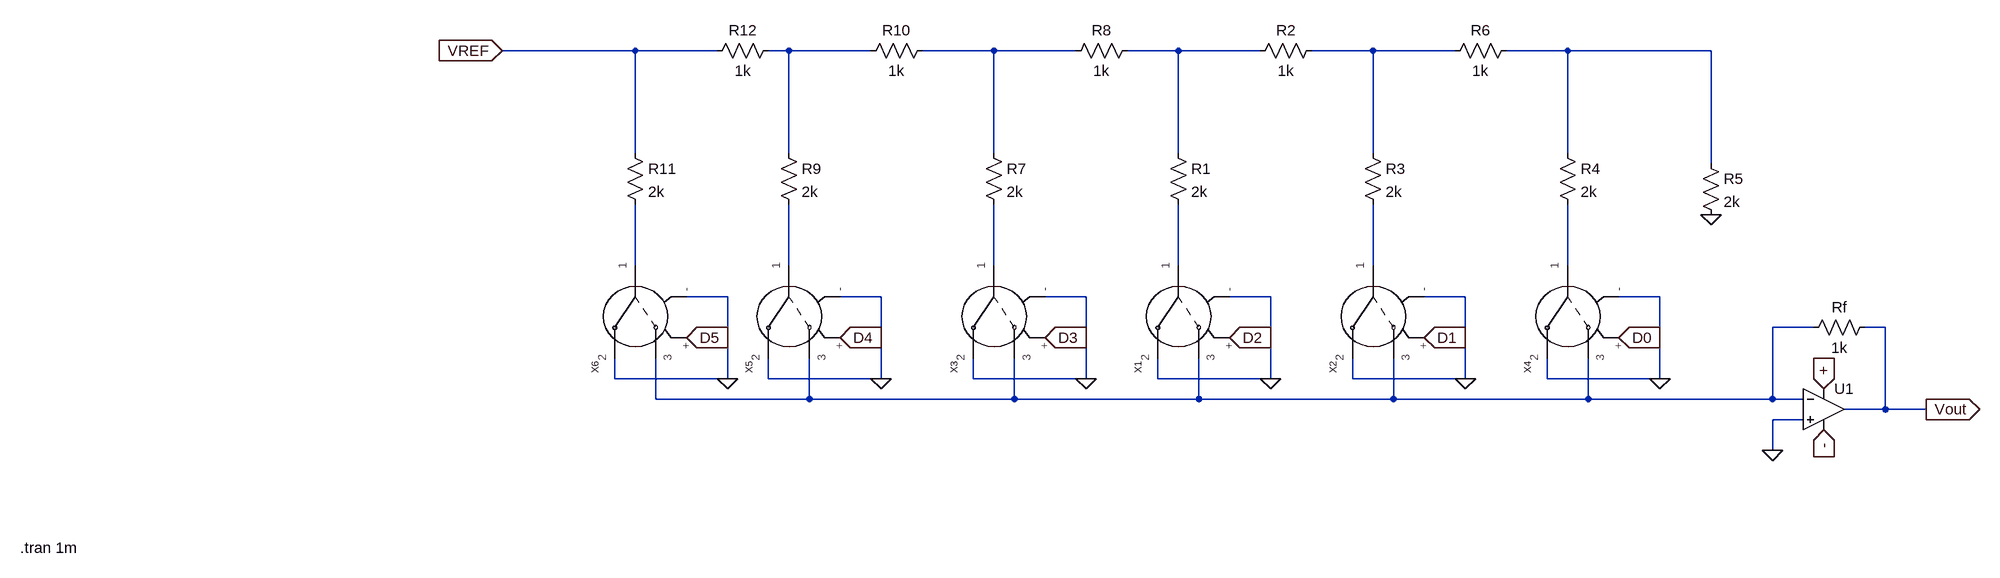
[diagram p0: schematic DAC_6 .asc]
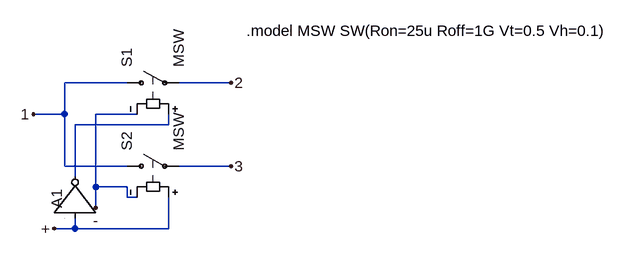
[diagram p1: sub-circuit spdt.asc]
DAC_6 .asc, the LTspice schematic file:
Version 4
SHEET 1 2528 680
WIRE 400 -320 192 -320
WIRE 528 -320 400 -320
WIRE 640 -320 608 -320
WIRE 768 -320 640 -320
WIRE 960 -320 848 -320
WIRE 1088 -320 960 -320
WIRE 1248 -320 1168 -320
WIRE 1376 -320 1248 -320
WIRE 1552 -320 1456 -320
WIRE 1680 -320 1552 -320
WIRE 1856 -320 1760 -320
WIRE 2080 -320 1856 -320
WIRE 400 -160 400 -320
WIRE 640 -160 640 -320
WIRE 960 -160 960 -320
WIRE 1248 -160 1248 -320
WIRE 1552 -160 1552 -320
WIRE 1856 -160 1856 -320
WIRE 2080 -144 2080 -320
WIRE 400 16 400 -80
WIRE 640 16 640 -80
WIRE 960 16 960 -80
WIRE 1248 16 1248 -80
WIRE 1552 16 1552 -80
WIRE 1856 16 1856 -80
WIRE 544 64 480 64
WIRE 784 64 720 64
WIRE 1104 64 1040 64
WIRE 1392 64 1328 64
WIRE 1696 64 1632 64
WIRE 2000 64 1936 64
WIRE 2240 112 2176 112
WIRE 2352 112 2320 112
WIRE 368 192 368 160
WIRE 544 192 544 64
WIRE 544 192 368 192
WIRE 608 192 608 160
WIRE 784 192 784 64
WIRE 784 192 608 192
WIRE 928 192 928 160
WIRE 1104 192 1104 64
WIRE 1104 192 928 192
WIRE 1216 192 1216 160
WIRE 1392 192 1392 64
WIRE 1392 192 1216 192
WIRE 1520 192 1520 160
WIRE 1696 192 1696 64
WIRE 1696 192 1520 192
WIRE 1824 192 1824 160
WIRE 2000 192 2000 64
WIRE 2000 192 1824 192
WIRE 432 224 432 160
WIRE 672 224 672 160
WIRE 672 224 432 224
WIRE 992 224 992 160
WIRE 992 224 672 224
WIRE 1280 224 1280 160
WIRE 1280 224 992 224
WIRE 1584 224 1584 160
WIRE 1584 224 1280 224
WIRE 1888 224 1888 160
WIRE 1888 224 1584 224
WIRE 2176 224 2176 112
WIRE 2176 224 1888 224
WIRE 2224 224 2176 224
WIRE 2352 240 2352 112
WIRE 2352 240 2288 240
WIRE 2416 240 2352 240
WIRE 2224 256 2176 256
WIRE 2176 304 2176 256
FLAG 2080 -64 0
FLAG 2416 240 Vout
IOPIN 2416 240 Out
FLAG 2176 304 0
FLAG 1936 128 D0
IOPIN 1936 128 In
FLAG 2000 192 0
FLAG 1632 128 D1
IOPIN 1632 128 In
FLAG 1696 192 0
FLAG 192 -320 VREF
IOPIN 192 -320 In
FLAG 2256 208 +
IOPIN 2256 208 In
FLAG 2256 272 -
IOPIN 2256 272 In
FLAG 1328 128 D2
IOPIN 1328 128 In
FLAG 1392 192 0
FLAG 1040 128 D3
IOPIN 1040 128 In
FLAG 1104 192 0
FLAG 720 128 D4
IOPIN 720 128 In
FLAG 784 192 0
FLAG 480 128 D5
IOPIN 480 128 In
FLAG 544 192 0
SYMBOL SPDT 1856 64 M90
SYMATTR InstName X4
SYMBOL res 1536 -176 R0
SYMATTR InstName R3
SYMATTR Value 2k
SYMBOL res 1840 -176 R0
SYMATTR InstName R4
SYMATTR Value 2k
SYMBOL res 2064 -160 R0
SYMATTR InstName R5
SYMATTR Value 2k
SYMBOL res 1776 -336 R90
WINDOW 0 0 56 VBottom 2
WINDOW 3 32 56 VTop 2
SYMATTR InstName R6
SYMATTR Value 1k
SYMBOL res 2336 96 R90
WINDOW 0 0 56 VBottom 2
WINDOW 3 32 56 VTop 2
SYMATTR InstName Rf
SYMATTR Value 1k
SYMBOL OpAmps\\UniversalOpAmp 2256 240 R0
SYMATTR InstName U1
SYMBOL SPDT 1552 64 M90
SYMATTR InstName X2
SYMBOL res 1232 -176 R0
SYMATTR InstName R1
SYMATTR Value 2k
SYMBOL res 1472 -336 R90
WINDOW 0 0 56 VBottom 2
WINDOW 3 32 56 VTop 2
SYMATTR InstName R2
SYMATTR Value 1k
SYMBOL SPDT 1248 64 M90
SYMATTR InstName X1
SYMBOL res 944 -176 R0
SYMATTR InstName R7
SYMATTR Value 2k
SYMBOL res 1184 -336 R90
WINDOW 0 0 56 VBottom 2
WINDOW 3 32 56 VTop 2
SYMATTR InstName R8
SYMATTR Value 1k
SYMBOL SPDT 960 64 M90
SYMATTR InstName X3
SYMBOL res 624 -176 R0
SYMATTR InstName R9
SYMATTR Value 2k
SYMBOL res 864 -336 R90
WINDOW 0 0 56 VBottom 2
WINDOW 3 32 56 VTop 2
SYMATTR InstName R10
SYMATTR Value 1k
SYMBOL SPDT 640 64 M90
SYMATTR InstName X5
SYMBOL res 384 -176 R0
SYMATTR InstName R11
SYMATTR Value 2k
SYMBOL res 624 -336 R90
WINDOW 0 0 56 VBottom 2
WINDOW 3 32 56 VTop 2
SYMATTR InstName R12
SYMATTR Value 1k
SYMBOL SPDT 400 64 M90
SYMATTR InstName X6
TEXT -560 456 Left 2 !.tran 1m

spdt.asc, the sub-circuit schematic file:
Version 4
SHEET 1 932 680
WIRE 144 96 48 96
WIRE 304 96 224 96
WIRE 48 144 48 96
WIRE 48 144 0 144
WIRE 160 144 96 144
WIRE 208 160 208 144
WIRE 208 160 64 160
WIRE 48 224 48 144
WIRE 144 224 48 224
WIRE 304 224 224 224
WIRE 64 240 64 160
WIRE 96 256 96 144
WIRE 144 256 96 256
WIRE 144 272 144 256
WIRE 160 272 144 272
WIRE 96 288 96 256
WIRE 64 320 64 304
WIRE 64 320 32 320
WIRE 208 320 208 272
WIRE 208 320 64 320
FLAG 0 144 1
FLAG 304 96 2
FLAG 304 224 3
FLAG 32 320 +
FLAG 96 288 -
SYMBOL sw 128 96 R270
SYMATTR InstName S1
SYMATTR Value MSW
SYMBOL sw 128 224 R270
SYMATTR InstName S2
SYMATTR Value MSW
SYMBOL Digital\\inv 128 304 M270
WINDOW 3 8 60 Invisible 2
WINDOW 0 15 92 Left 2
SYMATTR Value td=10n Vhigh=5
SYMATTR InstName A1
TEXT 328 16 Left 2 !.model MSW SW(Ron=25u Roff=1G Vt=0.5 Vh=0.1)

The netlist it stands for:
* DAC_6 .asc
XX4 N011 0 N012 D0 0 spdt
R3 N004 N010 2k
R4 N005 N011 2k
R5 N005 0 2k
R6 N005 N004 1k
Rf Vout N012 1k
XU1 0 N012 + - Vout level1 Avol=1Meg GBW=10Meg Vos=0 En=0 Enk=0 In=0 Ink=0 Rin=500Meg  ; pins In+ In- V+ V- OUT
XX2 N010 0 N012 D1 0 spdt
R1 N003 N009 2k
R2 N004 N003 1k
XX1 N009 0 N012 D2 0 spdt
R7 N002 N008 2k
R8 N003 N002 1k
XX3 N008 0 N012 D3 0 spdt
R9 N001 N007 2k
R10 N002 N001 1k
XX5 N007 0 N012 D4 0 spdt
R11 VREF N006 2k
R12 N001 VREF 1k
XX6 N006 0 N012 D5 0 spdt

* block symbol definitions
.subckt spdt 1 2 3 + -
S1 1 2 N001 - MSW
S2 1 3 + - MSW
A1 + 0 0 0 0 N001 0 0 BUF td=10n Vhigh=5
.model MSW SW(Ron=25u Roff=1G Vt=0.5 Vh=0.1)
.ends spdt

.tran 1m
.lib UniversalOpAmp1.lib
.backanno
.end